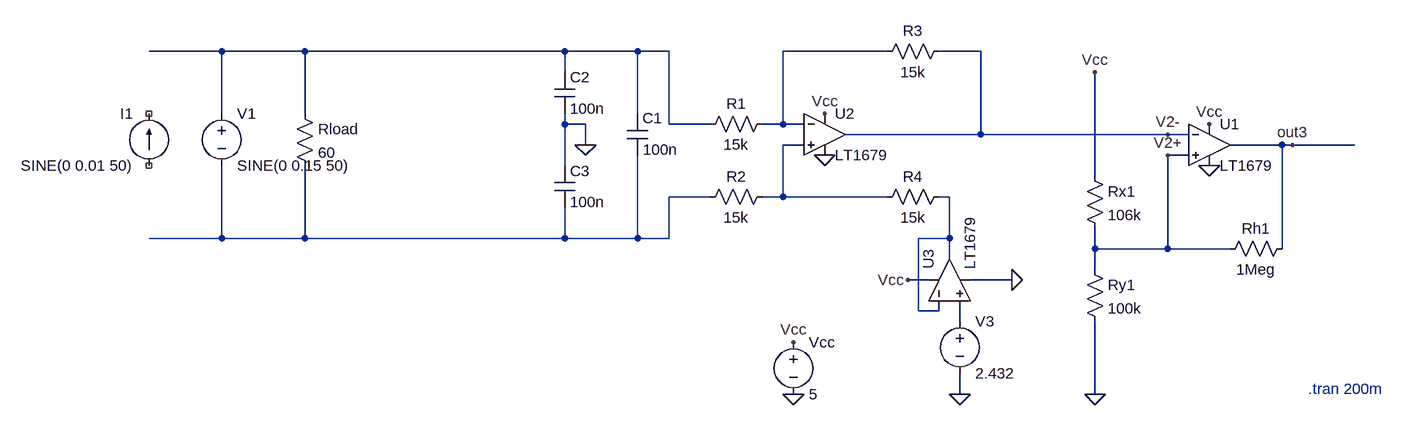
[diagram p0: schematic CurrentDetectionCircuit.asc]
CurrentDetectionCircuit.asc, the LTspice schematic file:
Version 4.1
SHEET 1 8372 3564
WIRE 5280 2704 5168 2704
WIRE 5408 2704 5280 2704
WIRE 5808 2704 5408 2704
WIRE 5920 2704 5808 2704
WIRE 5968 2704 5920 2704
WIRE 6304 2704 6144 2704
WIRE 6448 2704 6384 2704
WIRE 5808 2736 5808 2704
WIRE 5280 2800 5280 2704
WIRE 5408 2800 5408 2704
WIRE 5920 2800 5920 2704
WIRE 5808 2816 5808 2800
WIRE 5840 2816 5808 2816
WIRE 5968 2816 5968 2704
WIRE 6032 2816 5968 2816
WIRE 6144 2816 6144 2704
WIRE 6144 2816 6112 2816
WIRE 6176 2816 6144 2816
WIRE 6448 2832 6448 2704
WIRE 6448 2832 6240 2832
WIRE 6736 2832 6448 2832
WIRE 6768 2832 6736 2832
WIRE 5840 2848 5840 2816
WIRE 6176 2848 6144 2848
WIRE 6912 2848 6832 2848
WIRE 6928 2848 6912 2848
WIRE 7024 2848 6928 2848
WIRE 6768 2864 6736 2864
WIRE 5808 2880 5808 2816
WIRE 6624 2896 6624 2736
WIRE 6032 2928 5968 2928
WIRE 6144 2928 6144 2848
WIRE 6144 2928 6112 2928
WIRE 6304 2928 6144 2928
WIRE 6400 2928 6384 2928
WIRE 5280 2992 5280 2880
WIRE 5280 2992 5168 2992
WIRE 5408 2992 5408 2880
WIRE 5408 2992 5280 2992
WIRE 5808 2992 5808 2944
WIRE 5808 2992 5408 2992
WIRE 5920 2992 5920 2864
WIRE 5920 2992 5808 2992
WIRE 5968 2992 5968 2928
WIRE 5968 2992 5920 2992
WIRE 6400 2992 6400 2928
WIRE 6400 2992 6352 2992
WIRE 6624 3008 6624 2976
WIRE 6736 3008 6736 2864
WIRE 6736 3008 6624 3008
WIRE 6832 3008 6736 3008
WIRE 6912 3008 6912 2848
WIRE 6400 3024 6400 2992
WIRE 6624 3040 6624 3008
WIRE 6368 3056 6336 3056
WIRE 6496 3056 6432 3056
WIRE 6352 3104 6352 2992
WIRE 6384 3104 6384 3088
WIRE 6384 3104 6352 3104
WIRE 6416 3120 6416 3088
WIRE 6416 3232 6416 3200
WIRE 6624 3232 6624 3120
FLAG 5840 2848 0
FLAG 6736 2832 V2-
FLAG 6928 2848 out3
FLAG 6736 2864 V2+
FLAG 6160 3232 0
FLAG 6208 2800 Vcc
FLAG 6800 2816 Vcc
FLAG 6208 2864 0
FLAG 6800 2880 0
FLAG 6336 3056 Vcc
FLAG 6496 3056 0
FLAG 6624 3232 0
FLAG 6416 3232 0
FLAG 6624 2736 Vcc
FLAG 6160 3152 Vcc
SYMBOL cap 5936 2864 R180
WINDOW 0 -22 57 Left 2
WINDOW 3 8 9 Right 2
SYMATTR InstName C1
SYMATTR Value 100n
SYMBOL cap 5792 2736 R0
SYMATTR InstName C2
SYMATTR Value 100n
SYMBOL cap 5792 2880 R0
SYMATTR InstName C3
SYMATTR Value 100n
SYMBOL res 6128 2800 R90
WINDOW 0 0 56 VBottom 2
WINDOW 3 32 56 VTop 2
SYMATTR InstName R1
SYMATTR Value 15k
SYMBOL res 6400 2688 R90
WINDOW 0 0 56 VBottom 2
WINDOW 3 32 56 VTop 2
SYMATTR InstName R3
SYMATTR Value 15k
SYMBOL res 6400 2912 R90
WINDOW 0 0 56 VBottom 2
WINDOW 3 32 56 VTop 2
SYMATTR InstName R4
SYMATTR Value 15k
SYMBOL res 6128 2912 R90
WINDOW 0 0 56 VBottom 2
WINDOW 3 32 56 VTop 2
SYMATTR InstName R2
SYMATTR Value 15k
SYMBOL res 6608 2880 R0
SYMATTR InstName Rx1
SYMATTR Value 106k
SYMBOL res 6608 3024 R0
SYMATTR InstName Ry1
SYMATTR Value 100k
SYMBOL res 6928 2992 R90
WINDOW 0 0 56 VBottom 2
WINDOW 3 32 56 VTop 2
SYMATTR InstName Rh1
SYMATTR Value 1Meg
SYMBOL OpAmps\\LT1679 6800 2848 R0
SYMATTR InstName U1
SYMBOL OpAmps\\LT1679 6208 2832 R0
SYMATTR InstName U2
SYMBOL voltage 6416 3104 R0
SYMATTR InstName V3
SYMATTR Value 2.432
SYMBOL OpAmps\\LT1679 6400 3056 R270
SYMATTR InstName U3
SYMBOL voltage 6160 3136 R0
WINDOW 123 0 0 Left 0
WINDOW 39 0 0 Left 0
SYMATTR InstName Vcc
SYMATTR Value 5
SYMBOL res 5392 2784 R0
SYMATTR InstName Rload
SYMATTR Value 60
SYMBOL current 5168 2880 R180
WINDOW 0 24 80 Left 2
WINDOW 3 24 0 Left 2
WINDOW 123 0 0 Left 0
WINDOW 39 0 0 Left 0
SYMATTR InstName I1
SYMATTR Value SINE(0 0.01 50)
SYMBOL voltage 5280 2784 R0
WINDOW 123 0 0 Left 0
WINDOW 39 0 0 Left 0
SYMATTR InstName V1
SYMATTR Value SINE(0 0.15 50)
TEXT 6952 3224 Left 2 !.tran 200m
TEXT 6952 3224 Left 2 ;.tran 200m

The netlist it stands for:
* CurrentDetectionCircuit.asc
C1 N004 N001 100n
C2 N001 0 100n
C3 0 N004 100n
R1 N002 N001 15k
R3 V2- N002 15k
R4 N005 N003 15k
R2 N003 N004 15k
Rx1 Vcc V2+ 106k
Ry1 V2+ 0 100k
Rh1 out3 V2+ 1Meg
* U1: LT1679 (symbol OpAmps\LT1679 not available, pins judged from their places): In+=V2+ In-=V2- V+=Vcc V-=0 OUT=out3
* U2: LT1679 (symbol OpAmps\LT1679 not available, pins judged from their places): In+=N003 In-=N002 V+=Vcc V-=0 OUT=V2-
V3 N006 0 2.432
* U3: LT1679 (symbol OpAmps\LT1679 not available, pins judged from their places): In+=N006 In-=N005 V+=Vcc V-=0 OUT=N005
Vcc Vcc 0 5
Rload N001 N004 60
I1 NC_01 NC_02 SINE(0 0.01 50)
V1 N001 N004 SINE(0 0.15 50)
.tran 200m
* .tran 200m
.backanno
.end